# EAGLE schematic 8050a_led (EAGLE 9.2.2)
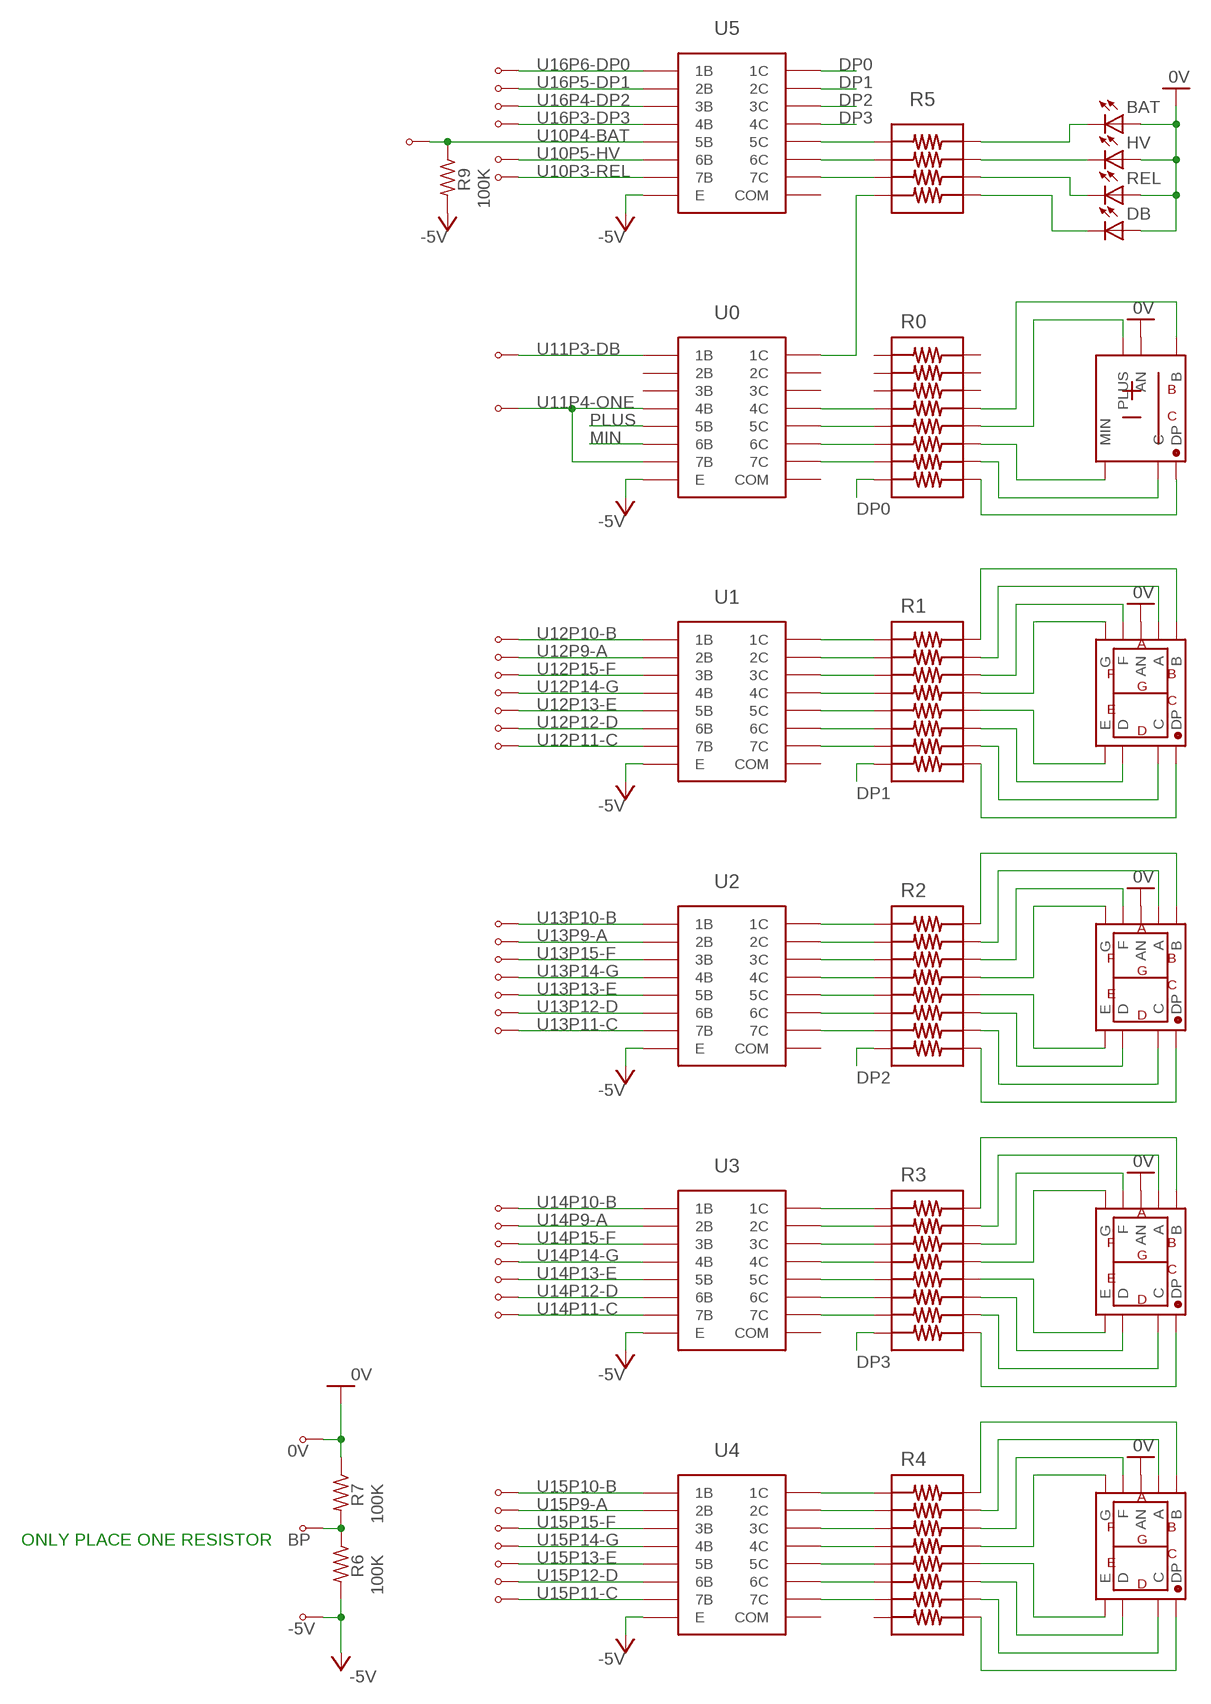
[diagram p0: schematic, sheet 1]

## Parts
BAT  LED_0805  [0805_POL]
D0  LUMEX_LDF-A5616RI  [LUMEX_LDS-A516RI]
D1  LUMEX_LDS-A516RI  [LUMEX_LDS-A516RI]
D2  LUMEX_LDS-A516RI  [LUMEX_LDS-A516RI]
D3  LUMEX_LDS-A516RI  [LUMEX_LDS-A516RI]
D4  LUMEX_LDS-A516RI  [LUMEX_LDS-A516RI]
DB  LED_0805  [0805_POL]
HV  LED_0805  [0805_POL]
R0  BOURNS_CAT16-XXXJ8  [BOURNS_CAT16-J8]
R1  BOURNS_CAT16-XXXJ8  [BOURNS_CAT16-J8]
R2  BOURNS_CAT16-XXXJ8  [BOURNS_CAT16-J8]
R3  BOURNS_CAT16-XXXJ8  [BOURNS_CAT16-J8]
R4  BOURNS_CAT16-XXXJ8  [BOURNS_CAT16-J8]
R5  BOURNS_CAT16XXXJ4  [BOURNS_CAT16-J4]
R6  100K  R_0603  [0603]
R7  100K  R_0603  [0603]
R9  100K  R_0603  [0603]
REL  LED_0805  [0805_POL]
TP1  KEYSTONE_500X  [KEYSTONE_500X]
TP2  KEYSTONE_500X  [KEYSTONE_500X]
TP3  KEYSTONE_500X  [KEYSTONE_500X]
TP4  KEYSTONE_500X  [KEYSTONE_500X]
TP5  KEYSTONE_500X  [KEYSTONE_500X]
TP6  KEYSTONE_500X  [KEYSTONE_500X]
TP7  KEYSTONE_500X  [KEYSTONE_500X]
TP8  KEYSTONE_500X  [KEYSTONE_500X]
TP9  KEYSTONE_500X  [KEYSTONE_500X]
TP10  KEYSTONE_500X  [KEYSTONE_500X]
TP11  KEYSTONE_500X  [KEYSTONE_500X]
TP12  KEYSTONE_500X  [KEYSTONE_500X]
TP13  KEYSTONE_500X  [KEYSTONE_500X]
TP14  KEYSTONE_500X  [KEYSTONE_500X]
TP15  KEYSTONE_500X  [KEYSTONE_500X]
TP16  KEYSTONE_500X  [KEYSTONE_500X]
TP17  KEYSTONE_500X  [KEYSTONE_500X]
TP18  KEYSTONE_500X  [KEYSTONE_500X]
TP19  KEYSTONE_500X  [KEYSTONE_500X]
TP20  KEYSTONE_500X  [KEYSTONE_500X]
TP21  KEYSTONE_500X  [KEYSTONE_500X]
TP22  KEYSTONE_500X  [KEYSTONE_500X]
TP23  KEYSTONE_500X  [KEYSTONE_500X]
TP24  KEYSTONE_500X  [KEYSTONE_500X]
TP25  KEYSTONE_500X  [KEYSTONE_500X]
TP26  KEYSTONE_500X  [KEYSTONE_500X]
TP27  KEYSTONE_500X  [KEYSTONE_500X]
TP28  KEYSTONE_500X  [KEYSTONE_500X]
TP29  KEYSTONE_500X  [KEYSTONE_500X]
TP30  KEYSTONE_500X  [KEYSTONE_500X]
TP31  KEYSTONE_500X  [KEYSTONE_500X]
TP32  KEYSTONE_500X  [KEYSTONE_500X]
TP35  KEYSTONE_500X  [KEYSTONE_500X]
TP36  KEYSTONE_500X  [KEYSTONE_500X]
TP37  KEYSTONE_500X  [KEYSTONE_500X]
TP38  KEYSTONE_500X  [KEYSTONE_500X]
TP39  KEYSTONE_500X  [KEYSTONE_500X]
TP40  KEYSTONE_500X  [KEYSTONE_500X]
TP41  KEYSTONE_500X  [KEYSTONE_500X]
TP42  KEYSTONE_500X  [KEYSTONE_500X]
U0  TI_ULN2003A  [SOIC16_TI]
U1  TI_ULN2003A  [SOIC16_TI]
U2  TI_ULN2003A  [SOIC16_TI]
U3  TI_ULN2003A  [SOIC16_TI]
U4  TI_ULN2003A  [SOIC16_TI]
U5  TI_ULN2003A  [SOIC16_TI]

## Nets
0V: BAT.P$1(A) D0.P$3(AN) D0.P$8(AN) D1.P$3(AN) D1.P$8(AN) D2.P$3(AN) D2.P$8(AN) D3.P$3(AN) D3.P$8(AN) D4.P$3(AN) D4.P$8(AN) DB.P$1(A) HV.P$1(A) R7.P$1 REL.P$1(A) TP9.P$1(TP)
-5V: R6.P$2 R9.P$2 TP8.P$1(TP) U0.P$8(E) U1.P$8(E) U2.P$8(E) U3.P$8(E) U4.P$8(E) U5.P$8(E)
BP: R6.P$1 R7.P$2 TP35.P$1(TP)
DP0: R0.P$8 U5.P$16(1C)
DP1: R1.P$8 U5.P$15(2C)
DP2: R2.P$8 U5.P$14(3C)
DP3: R3.P$8 U5.P$13(4C)
MIN: U0.P$6(6B)
N$1: R1.P$1 U1.P$16(1C)
N$2: R1.P$2 U1.P$15(2C)
N$3: R1.P$3 U1.P$14(3C)
N$4: R1.P$4 U1.P$13(4C)
N$5: R1.P$5 U1.P$12(5C)
N$6: R1.P$6 U1.P$11(6C)
N$7: R1.P$7 U1.P$10(7C)
N$8: D1.P$6(B) R1.P$16
N$9: D1.P$7(A) R1.P$15
N$10: D1.P$9(F) R1.P$14
N$11: D1.P$10(G) R1.P$13
N$12: D1.P$1(E) R1.P$12
N$13: D1.P$2(D) R1.P$11
N$14: D1.P$4(C) R1.P$10
N$15: D1.P$5(DP) R1.P$9
N$16: R2.P$1 U2.P$16(1C)
N$17: R2.P$2 U2.P$15(2C)
N$18: R2.P$3 U2.P$14(3C)
N$19: R2.P$4 U2.P$13(4C)
N$20: R2.P$5 U2.P$12(5C)
N$21: R2.P$6 U2.P$11(6C)
N$22: R2.P$7 U2.P$10(7C)
N$23: D2.P$6(B) R2.P$16
N$24: D2.P$7(A) R2.P$15
N$25: D2.P$9(F) R2.P$14
N$26: D2.P$10(G) R2.P$13
N$27: D2.P$1(E) R2.P$12
N$28: D2.P$2(D) R2.P$11
N$29: D2.P$4(C) R2.P$10
N$30: D2.P$5(DP) R2.P$9
N$31: R3.P$1 U3.P$16(1C)
N$32: R3.P$2 U3.P$15(2C)
N$33: R3.P$3 U3.P$14(3C)
N$34: R3.P$4 U3.P$13(4C)
N$35: R3.P$5 U3.P$12(5C)
N$36: R3.P$6 U3.P$11(6C)
N$37: R3.P$7 U3.P$10(7C)
N$38: D3.P$6(B) R3.P$16
N$39: D3.P$7(A) R3.P$15
N$40: D3.P$9(F) R3.P$14
N$41: D3.P$10(G) R3.P$13
N$42: D3.P$1(E) R3.P$12
N$43: D3.P$2(D) R3.P$11
N$44: D3.P$4(C) R3.P$10
N$45: D3.P$5(DP) R3.P$9
N$46: R4.P$1 U4.P$16(1C)
N$47: R4.P$2 U4.P$15(2C)
N$48: R4.P$3 U4.P$14(3C)
N$49: R4.P$4 U4.P$13(4C)
N$50: R4.P$5 U4.P$12(5C)
N$51: R4.P$6 U4.P$11(6C)
N$52: R4.P$7 U4.P$10(7C)
N$53: D4.P$6(B) R4.P$16
N$54: D4.P$7(A) R4.P$15
N$55: D4.P$9(F) R4.P$14
N$56: D4.P$10(G) R4.P$13
N$57: D4.P$1(E) R4.P$12
N$58: D4.P$2(D) R4.P$11
N$59: D4.P$4(C) R4.P$10
N$60: D4.P$5(DP) R4.P$9
N$61: R0.P$7 U0.P$10(7C)
N$62: R0.P$6 U0.P$11(6C)
N$63: R0.P$5 U0.P$12(5C)
N$64: R5.P$3 U5.P$10(7C)
N$65: R5.P$2 U5.P$11(6C)
N$66: R5.P$1 U5.P$12(5C)
N$67: R5.P$4 U0.P$16(1C)
N$68: R0.P$4 U0.P$13(4C)
N$69: HV.P$2(C) R5.P$7
N$70: R5.P$6 REL.P$2(C)
N$71: DB.P$2(C) R5.P$5
N$72: BAT.P$2(C) R5.P$8
N$73: D0.P$9(PLUS) R0.P$12
N$74: D0.P$6(B) R0.P$13
N$75: D0.P$1(MIN) R0.P$11
N$76: D0.P$4(C) R0.P$10
N$77: D0.P$5(DP) R0.P$9
PLUS: U0.P$5(5B)
U10P3-REL: TP42.P$1(TP) U5.P$7(7B)
U10P4-BAT: R9.P$1 TP40.P$1(TP) U5.P$5(5B)
U10P5-HV: TP41.P$1(TP) U5.P$6(6B)
U11P3-DB: TP32.P$1(TP) U0.P$1(1B)
U11P4-ONE: TP31.P$1(TP) U0.P$4(4B) U0.P$7(7B)
U12P9-A: TP2.P$1(TP) U1.P$2(2B)
U12P10-B: TP1.P$1(TP) U1.P$1(1B)
U12P11-C: TP7.P$1(TP) U1.P$7(7B)
U12P12-D: TP6.P$1(TP) U1.P$6(6B)
U12P13-E: TP5.P$1(TP) U1.P$5(5B)
U12P14-G: TP4.P$1(TP) U1.P$4(4B)
U12P15-F: TP3.P$1(TP) U1.P$3(3B)
U13P9-A: TP11.P$1(TP) U2.P$2(2B)
U13P10-B: TP10.P$1(TP) U2.P$1(1B)
U13P11-C: TP16.P$1(TP) U2.P$7(7B)
U13P12-D: TP15.P$1(TP) U2.P$6(6B)
U13P13-E: TP14.P$1(TP) U2.P$5(5B)
U13P14-G: TP13.P$1(TP) U2.P$4(4B)
U13P15-F: TP12.P$1(TP) U2.P$3(3B)
U14P9-A: TP18.P$1(TP) U3.P$2(2B)
U14P10-B: TP17.P$1(TP) U3.P$1(1B)
U14P11-C: TP23.P$1(TP) U3.P$7(7B)
U14P12-D: TP22.P$1(TP) U3.P$6(6B)
U14P13-E: TP21.P$1(TP) U3.P$5(5B)
U14P14-G: TP20.P$1(TP) U3.P$4(4B)
U14P15-F: TP19.P$1(TP) U3.P$3(3B)
U15P9-A: TP25.P$1(TP) U4.P$2(2B)
U15P10-B: TP24.P$1(TP) U4.P$1(1B)
U15P11-C: TP30.P$1(TP) U4.P$7(7B)
U15P12-D: TP29.P$1(TP) U4.P$6(6B)
U15P13-E: TP28.P$1(TP) U4.P$5(5B)
U15P14-G: TP27.P$1(TP) U4.P$4(4B)
U15P15-F: TP26.P$1(TP) U4.P$3(3B)
U16P3-DP3: TP39.P$1(TP) U5.P$4(4B)
U16P4-DP2: TP38.P$1(TP) U5.P$3(3B)
U16P5-DP1: TP37.P$1(TP) U5.P$2(2B)
U16P6-DP0: TP36.P$1(TP) U5.P$1(1B)
Unconnected: R0.P$1 R0.P$2 R0.P$3 R0.P$14 R0.P$15 R0.P$16 R4.P$8 U0.P$2(2B) U0.P$3(3B) U0.P$9(COM) U0.P$14(3C) U0.P$15(2C) U1.P$9(COM) U2.P$9(COM) U3.P$9(COM) U4.P$9(COM) U5.P$9(COM)

## Notes on the sheet
- ONLY PLACE ONE RESISTOR

## Library data of the parts
BAT DB HV REL = travis:LED_0805
D0 = travis:LUMEX_LDF-A5616RI
D1-D4 = travis:LUMEX_LDS-A516RI
R0 R1-R4 = travis:BOURNS_CAT16-XXXJ8
R5 = travis:BOURNS_CAT16XXXJ4
R6 R7 R9 = travis:R_0603
TP1-TP32 TP35-TP42 = travis:KEYSTONE_500X
U0 U1-U5 = travis:TI_ULN2003A